# Altium schematic sheet fpga.schdoc
size 350 x 299 mm; Device: A_Customize; Symbol: A_Customize; Name: A_Customize; @Project Name: Odin; REV: 1.0; Date: 2024-09-23; Sheet: 1/1; Draw By: hsinr, ohenley; Company: 12410613_Canada_Corporation; Convert to PCB: yes; Add into BOM: yes; @Page No: 1; @Page Count: 10; @Schematic Name: Odin; @Board Name: Odin_V1.0.0; @Update Date: 2025-12-18; @Create Time: 14:52:40; @Update Time: 10:12:34; @Page Name: fpga; @Create Date: 2025-02-28
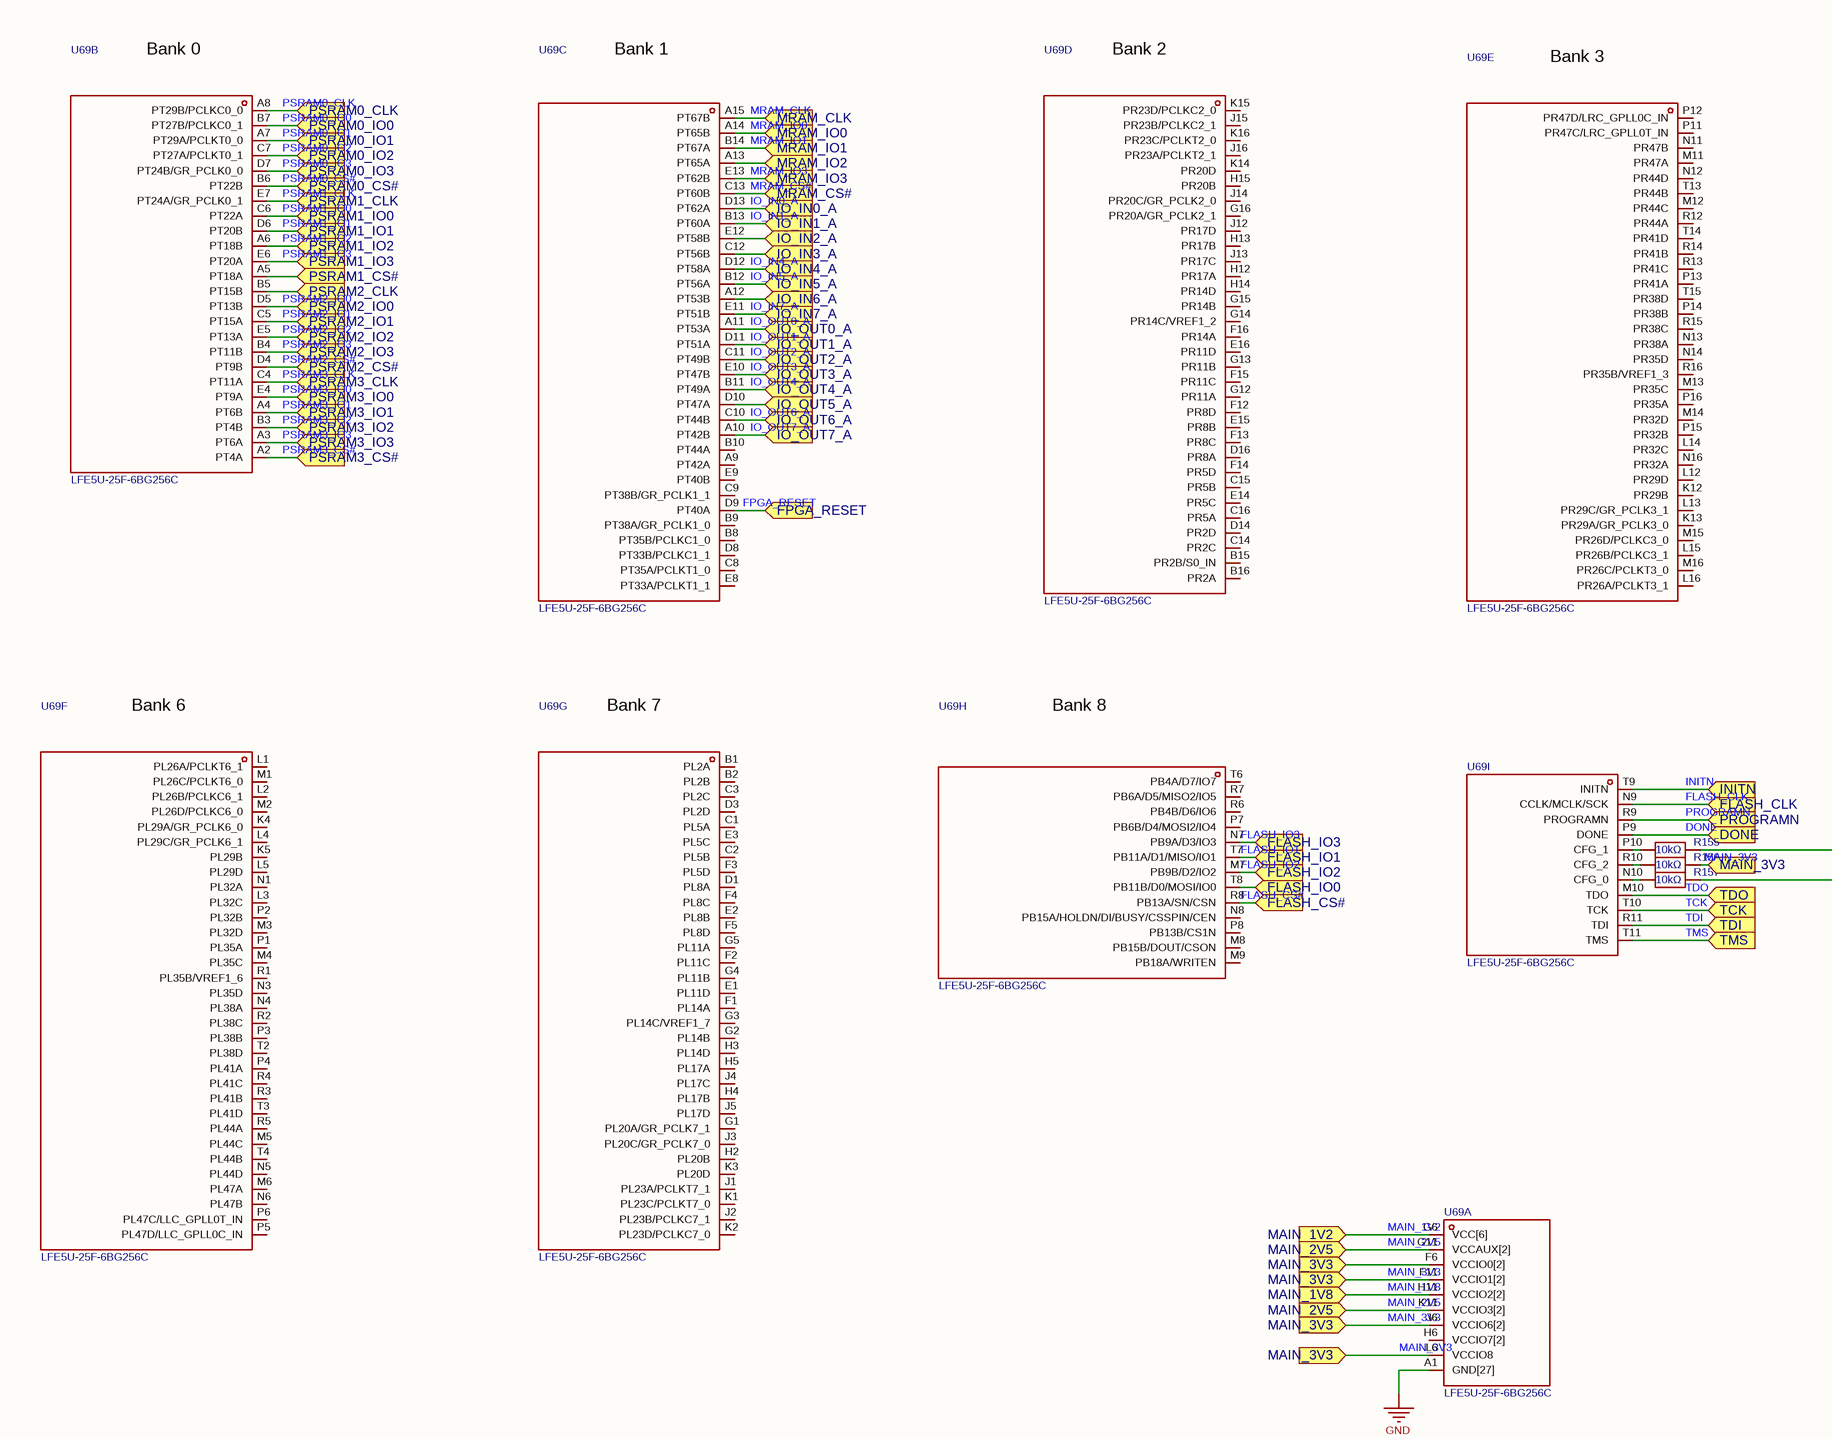
[diagram p0: fpga.schdoc, top left]
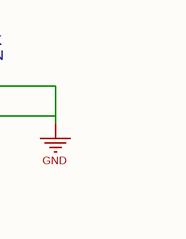
[diagram p1: fpga.schdoc, top right]
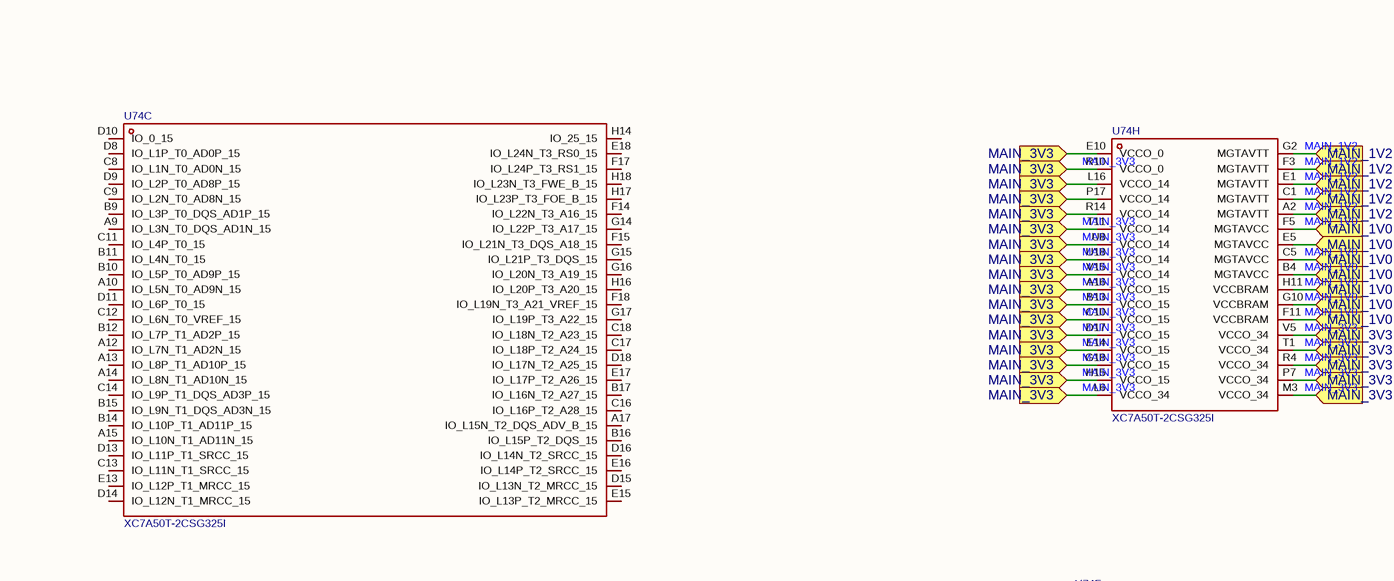
[diagram p2: fpga.schdoc, centre left]
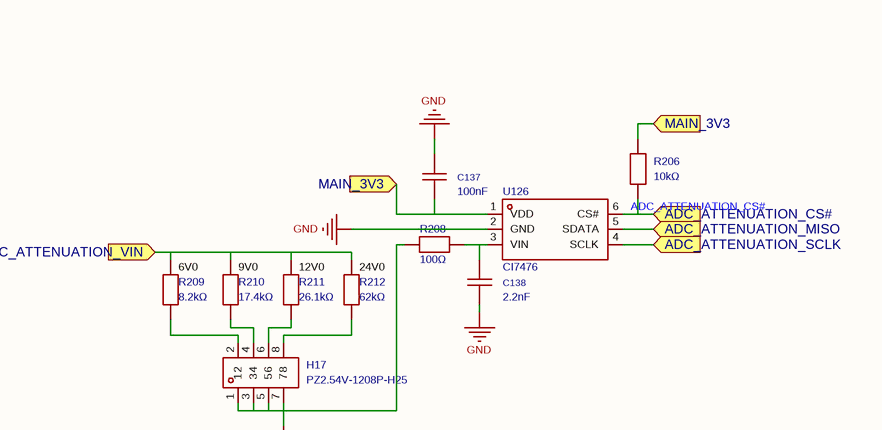
[diagram p3: fpga.schdoc, centre right]
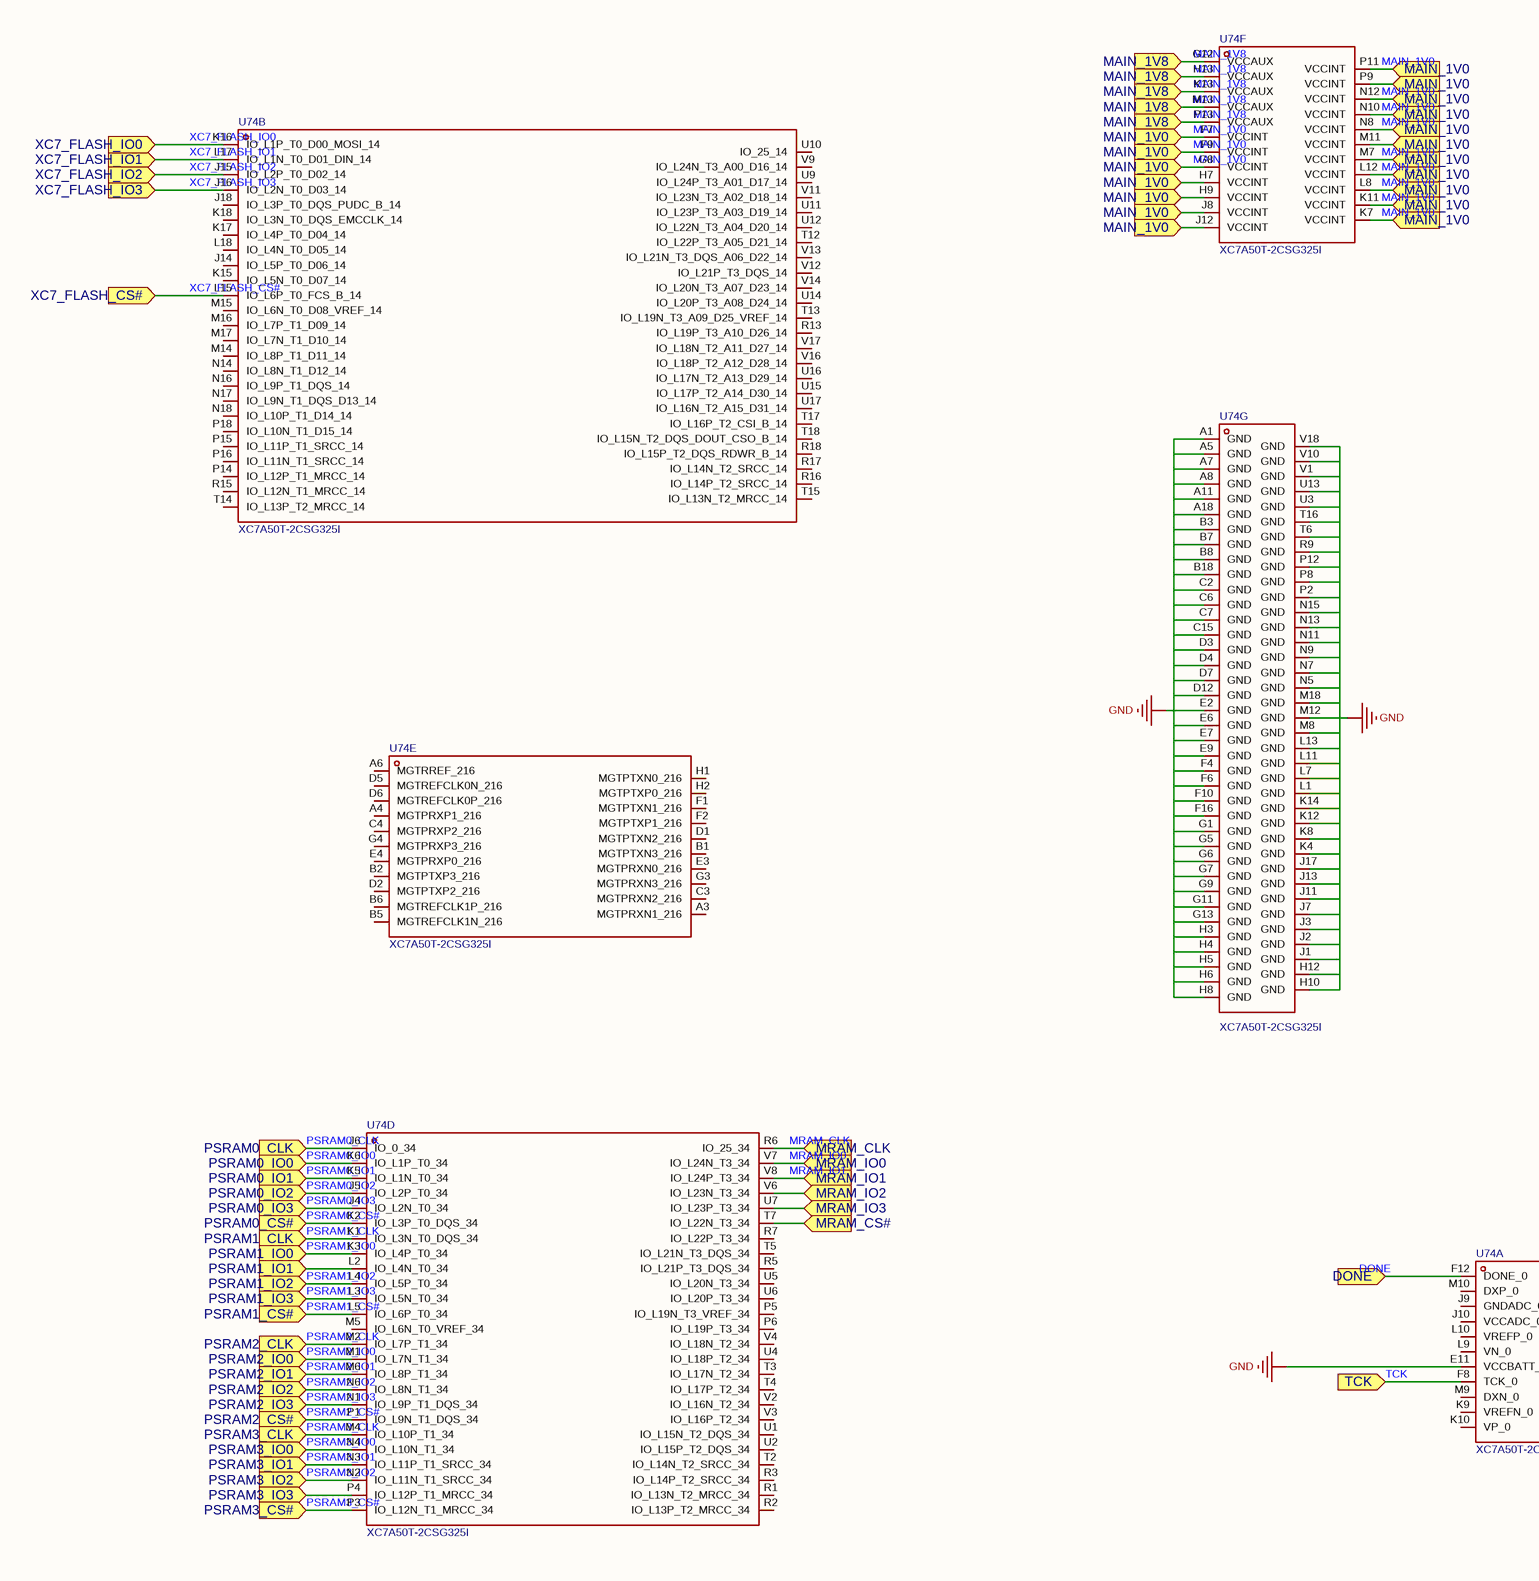
[diagram p4: fpga.schdoc, bottom left]
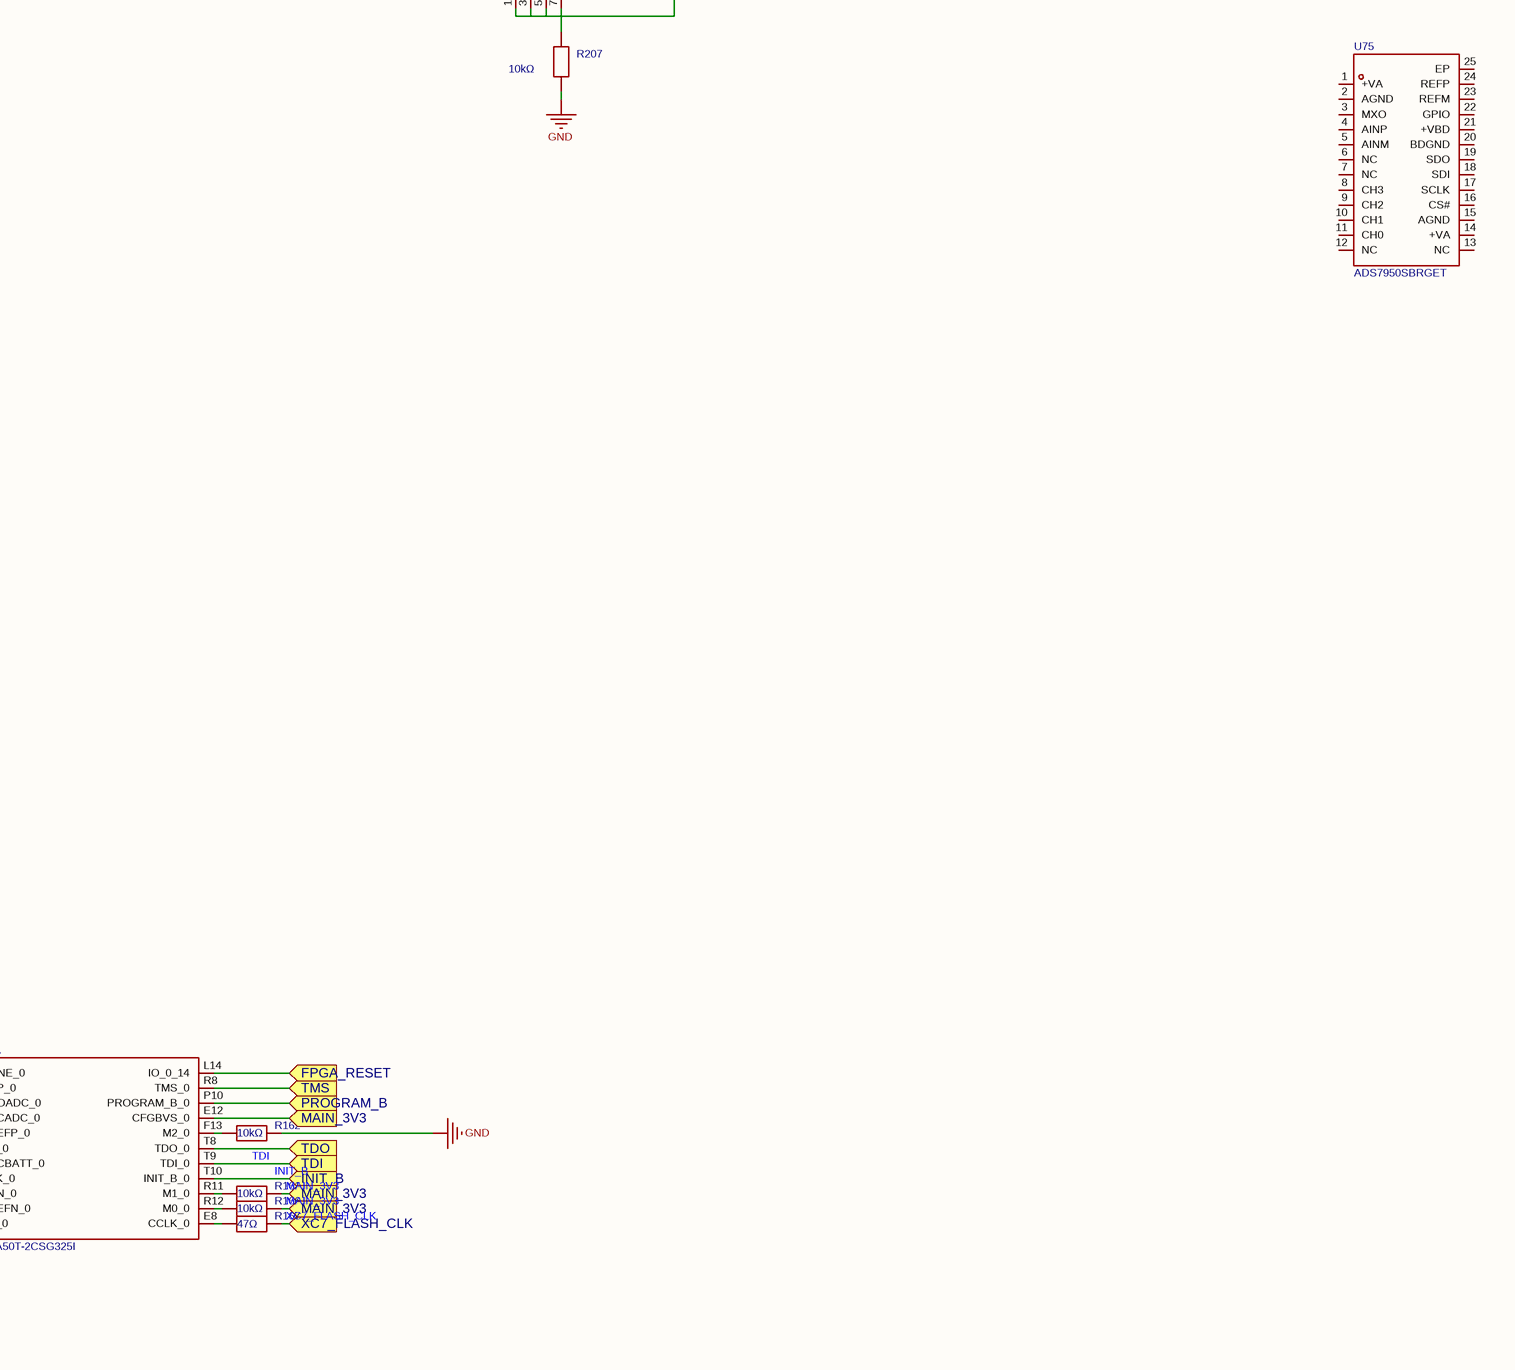
[diagram p5: fpga.schdoc, bottom right]

## Parts
C137  100nF  [C0603]
C138  2.2nF  [C0603]
H17  PZ2.54V-1208P-H25  [HDR-TH_8P-P2.54-V-M-R2-C4-S2.54]
R155  10kΩ  [R0402]
R156  10kΩ  [R0402]
R157  10kΩ  [R0402]
R161  10kΩ  [R0402]
R162  10kΩ  [R0402]
R166  10kΩ  [R0402]
R167  47Ω  [R0402]
R206  10kΩ  [R0402]
R207  10kΩ  [R0402]
R208  100Ω  [R0402]
R209  8.2kΩ  [R0402]
R210  17.4kΩ  [R0402]
R211  26.1kΩ  [R0402]
R212  62kΩ  [R0402]
U69  LFE5U-25F-6BG256C  [CABGA-256_L14.0-W14.0-R16-C16-P0.80-TL]  (parts A,B,C,D,E,F,G,H,I of 9)
U74  XC7A50T-2CSG325I  [NFBGA-324_L15.0-W15.0-R18-C18-P0.80-BL]  (parts A,B,C,D,E,F,G,H of 8)
U75  ADS7950SBRGET  [VQFN-24_L4.0-W4.0-P0.50-TL-EP2.7]
U126  CI7476  [SOT-23-6_L2.9-W1.6-P0.95-LS2.8-BR]

## Ports
ADC_ATTENUATION_CS# (in), ADC_ATTENUATION_MISO (in), ADC_ATTENUATION_SCLK (in), ADC_ATTENUATION_VIN (in), DONE (in), FLASH_CLK (in), FLASH_CS# (in), FLASH_IO0 (in), FLASH_IO1 (in), FLASH_IO2 (in), FLASH_IO3 (in), FPGA_RESET (in), INIT_B (in), INITN (in), IO_IN0_A (in), IO_IN1_A (in), IO_IN2_A (in), IO_IN3_A (in), IO_IN4_A (in), IO_IN5_A (in), IO_IN6_A (in), IO_IN7_A (in), IO_OUT0_A (in), IO_OUT1_A (in), IO_OUT2_A (in), IO_OUT3_A (in), IO_OUT4_A (in), IO_OUT5_A (in), IO_OUT6_A (in), IO_OUT7_A (in), MAIN_1V0 (in), MAIN_1V2 (in), MAIN_1V8 (in), MAIN_2V5 (in), MAIN_3V3 (in), MRAM_CLK (in), MRAM_CS# (in), MRAM_IO0 (in), MRAM_IO1 (in), MRAM_IO2 (in), MRAM_IO3 (in), PROGRAM_B (in), PROGRAMN (in), PSRAM0_CLK (in), PSRAM0_CS# (in), PSRAM0_IO0 (in), PSRAM0_IO1 (in), PSRAM0_IO2 (in), PSRAM0_IO3 (in), PSRAM1_CLK (in), PSRAM1_CS# (in), PSRAM1_IO0 (in), PSRAM1_IO1 (in), PSRAM1_IO2 (in), PSRAM1_IO3 (in), PSRAM2_CLK (in), PSRAM2_CS# (in), PSRAM2_IO0 (in), PSRAM2_IO1 (in), PSRAM2_IO2 (in), PSRAM2_IO3 (in), PSRAM3_CLK (in), PSRAM3_CS# (in), PSRAM3_IO0 (in), PSRAM3_IO1 (in), PSRAM3_IO2 (in), PSRAM3_IO3 (in), TCK (in), TDI (in), TDO (in), TMS (in), XC7_FLASH_CLK (in), XC7_FLASH_CS# (in), XC7_FLASH_IO0 (in), XC7_FLASH_IO1 (in), XC7_FLASH_IO2 (in), XC7_FLASH_IO3 (in)

## Nets
GND: C137.2 C138.2 R155.1 R157.1 R162.1 R207.2 U69.A1(GND[27]) U74.A1(GND) U74.A5(GND) U74.A7(GND) U74.A8(GND) U74.A11(GND) U74.A18(GND) U74.B3(GND) U74.B7(GND) U74.B8(GND) U74.B18(GND) U74.C2(GND) U74.C6(GND) U74.C7(GND) U74.C15(GND) U74.D3(GND) U74.D4(GND) U74.D7(GND) U74.D12(GND) U74.E2(GND) U74.E6(GND) U74.E7(GND) U74.E9(GND) U74.E11(VCCBATT_0) U74.F4(GND) U74.F6(GND) U74.F10(GND) U74.F16(GND) U74.G1(GND) U74.G5(GND) U74.G6(GND) U74.G7(GND) U74.G9(GND) U74.G11(GND) U74.G13(GND) U74.H3(GND) U74.H4(GND) U74.H5(GND) U74.H6(GND) U74.H8(GND) U74.H10(GND) U74.H12(GND) U74.J1(GND) U74.J2(GND) U74.J3(GND) U74.J7(GND) U74.J11(GND) U74.J13(GND) U74.J17(GND) U74.K4(GND) U74.K8(GND) U74.K12(GND) U74.K14(GND) U74.L1(GND) U74.L7(GND) U74.L11(GND) U74.L13(GND) U74.M8(GND) U74.M12(GND) U74.M18(GND) U74.N5(GND) U74.N7(GND) U74.N9(GND) U74.N11(GND) U74.N13(GND) U74.N15(GND) U74.P2(GND) U74.P8(GND) U74.P12(GND) U74.R9(GND) U74.T6(GND) U74.T16(GND) U74.U3(GND) U74.U13(GND) U74.V1(GND) U74.V10(GND) U74.V18(GND) U126.2(GND)
ADC_ATTENUATION_CS#: R206.2 U126.6(CS#) ; port ADC_ATTENUATION_CS#
ADC_ATTENUATION_MISO: U126.5(SDATA) ; port ADC_ATTENUATION_MISO
ADC_ATTENUATION_SCLK: U126.4(SCLK) ; port ADC_ATTENUATION_SCLK
ADC_ATTENUATION_VIN: R209.2 R210.2 R211.2 R212.2 ; port ADC_ATTENUATION_VIN
DONE: U69.P9(DONE) U74.F12(DONE_0) ; port DONE
FLASH_CLK: U69.N9(CCLK/MCLK/SCK) ; port FLASH_CLK
FLASH_CS#: U69.R8(PB13A/SN/CSN) ; port FLASH_CS#
FLASH_IO0: U69.T8(PB11B/D0/MOSI/IO0) ; port FLASH_IO0
FLASH_IO1: U69.T7(PB11A/D1/MISO/IO1) ; port FLASH_IO1
FLASH_IO2: U69.M7(PB9B/D2/IO2) ; port FLASH_IO2
FLASH_IO3: U69.N7(PB9A/D3/IO3) ; port FLASH_IO3
FPGA_RESET: U69.D9(PT40A) U74.L14(IO_0_14) ; port FPGA_RESET
INIT_B: U74.T10(INIT_B_0) ; port INIT_B
INITN: U69.T9(INITN) ; port INITN
IO_IN0_A: U69.D13(PT62A) ; port IO_IN0_A
IO_IN1_A: U69.B13(PT60A) ; port IO_IN1_A
IO_IN2_A: U69.E12(PT58B) ; port IO_IN2_A
IO_IN3_A: U69.C12(PT56B) ; port IO_IN3_A
IO_IN4_A: U69.D12(PT58A) ; port IO_IN4_A
IO_IN5_A: U69.B12(PT56A) ; port IO_IN5_A
IO_IN6_A: U69.A12(PT53B) ; port IO_IN6_A
IO_IN7_A: U69.E11(PT51B) ; port IO_IN7_A
IO_OUT0_A: U69.A11(PT53A) ; port IO_OUT0_A
IO_OUT1_A: U69.D11(PT51A) ; port IO_OUT1_A
IO_OUT2_A: U69.C11(PT49B) ; port IO_OUT2_A
IO_OUT3_A: U69.E10(PT47B) ; port IO_OUT3_A
IO_OUT4_A: U69.B11(PT49A) ; port IO_OUT4_A
IO_OUT5_A: U69.D10(PT47A) ; port IO_OUT5_A
IO_OUT6_A: U69.C10(PT44B) ; port IO_OUT6_A
IO_OUT7_A: U69.A10(PT42B) ; port IO_OUT7_A
MAIN_1V0: U74.B4(MGTAVCC) U74.C5(MGTAVCC) U74.E5(MGTAVCC) U74.F5(MGTAVCC) U74.F7(VCCINT) U74.F9(VCCINT) U74.F11(VCCBRAM) U74.G8(VCCINT) U74.G10(VCCBRAM) U74.H7(VCCINT) U74.H9(VCCINT) U74.H11(VCCBRAM) U74.J8(VCCINT) U74.J12(VCCINT) U74.K7(VCCINT) U74.K11(VCCINT) U74.L8(VCCINT) U74.L12(VCCINT) U74.M7(VCCINT) U74.M11(VCCINT) U74.N8(VCCINT) U74.N10(VCCINT) U74.N12(VCCINT) U74.P9(VCCINT) U74.P11(VCCINT) ; port MAIN_1V0
MAIN_1V2: U69.G6(VCC[6]) U74.A2(MGTAVTT) U74.C1(MGTAVTT) U74.E1(MGTAVTT) U74.F3(MGTAVTT) U74.G2(MGTAVTT) ; port MAIN_1V2
MAIN_1V8: U69.H11(VCCIO2[2]) U74.G12(VCCAUX) U74.H13(VCCAUX) U74.K13(VCCAUX) U74.M13(VCCAUX) U74.P13(VCCAUX) ; port MAIN_1V8
MAIN_2V5: U69.G11(VCCAUX[2]) U69.K11(VCCIO3[2]) ; port MAIN_2V5
MAIN_3V3: C137.1 R156.1 R161.1 R166.1 R206.1 U69.F6(VCCIO0[2]) U69.F11(VCCIO1[2]) U69.J6(VCCIO6[2]) U69.L6(VCCIO8) U74.A16(VCCO_15) U74.B13(VCCO_15) U74.C10(VCCO_15) U74.D17(VCCO_15) U74.E10(VCCO_0) U74.E12(CFGBVS_0) U74.E14(VCCO_15) U74.G18(VCCO_15) U74.H15(VCCO_15) U74.L6(VCCO_34) U74.L16(VCCO_14) U74.M3(VCCO_34) U74.P7(VCCO_34) U74.P17(VCCO_14) U74.R4(VCCO_34) U74.R10(VCCO_0) U74.R14(VCCO_14) U74.T1(VCCO_34) U74.T11(VCCO_14) U74.U8(VCCO_14) U74.U18(VCCO_14) U74.V5(VCCO_34) U74.V15(VCCO_14) U126.1(VDD) ; port MAIN_3V3
MRAM_CLK: U69.A15(PT67B) U74.R6(IO_25_34) ; port MRAM_CLK
MRAM_CS#: U69.C13(PT60B) U74.T7(IO_L22N_T3_34) ; port MRAM_CS#
MRAM_IO0: U69.A14(PT65B) U74.V7(IO_L24N_T3_34) ; port MRAM_IO0
MRAM_IO1: U69.B14(PT67A) U74.V8(IO_L24P_T3_34) ; port MRAM_IO1
MRAM_IO2: U69.A13(PT65A) U74.V6(IO_L23N_T3_34) ; port MRAM_IO2
MRAM_IO3: U69.E13(PT62B) U74.U7(IO_L23P_T3_34) ; port MRAM_IO3
PROGRAM_B: U74.P10(PROGRAM_B_0) ; port PROGRAM_B
PROGRAMN: U69.R9(PROGRAMN) ; port PROGRAMN
PSRAM0_CLK: U69.A8(PT29B/PCLKC0_0) U74.J6(IO_0_34) ; port PSRAM0_CLK
PSRAM0_CS#: U69.B6(PT22B) U74.K2(IO_L3P_T0_DQS_34) ; port PSRAM0_CS#
PSRAM0_IO0: U69.B7(PT27B/PCLKC0_1) U74.K6(IO_L1P_T0_34) ; port PSRAM0_IO0
PSRAM0_IO1: U69.A7(PT29A/PCLKT0_0) U74.K5(IO_L1N_T0_34) ; port PSRAM0_IO1
PSRAM0_IO2: U69.C7(PT27A/PCLKT0_1) U74.J5(IO_L2P_T0_34) ; port PSRAM0_IO2
PSRAM0_IO3: U69.D7(PT24B/GR_PCLK0_0) U74.J4(IO_L2N_T0_34) ; port PSRAM0_IO3
PSRAM1_CLK: U69.E7(PT24A/GR_PCLK0_1) U74.K1(IO_L3N_T0_DQS_34) ; port PSRAM1_CLK
PSRAM1_CS#: U69.A5(PT18A) U74.L5(IO_L6P_T0_34) ; port PSRAM1_CS#
PSRAM1_IO0: U69.C6(PT22A) U74.K3(IO_L4P_T0_34) ; port PSRAM1_IO0
PSRAM1_IO1: U69.D6(PT20B) U74.L2(IO_L4N_T0_34) ; port PSRAM1_IO1
PSRAM1_IO2: U69.A6(PT18B) U74.L4(IO_L5P_T0_34) ; port PSRAM1_IO2
PSRAM1_IO3: U69.E6(PT20A) U74.L3(IO_L5N_T0_34) ; port PSRAM1_IO3
PSRAM2_CLK: U69.B5(PT15B) U74.M2(IO_L7P_T1_34) ; port PSRAM2_CLK
PSRAM2_CS#: U69.D4(PT9B) U74.P1(IO_L9N_T1_DQS_34) ; port PSRAM2_CS#
PSRAM2_IO0: U69.D5(PT13B) U74.M1(IO_L7N_T1_34) ; port PSRAM2_IO0
PSRAM2_IO1: U69.C5(PT15A) U74.M6(IO_L8P_T1_34) ; port PSRAM2_IO1
PSRAM2_IO2: U69.E5(PT13A) U74.N6(IO_L8N_T1_34) ; port PSRAM2_IO2
PSRAM2_IO3: U69.B4(PT11B) U74.N1(IO_L9P_T1_DQS_34) ; port PSRAM2_IO3
PSRAM3_CLK: U69.C4(PT11A) U74.M4(IO_L10P_T1_34) ; port PSRAM3_CLK
PSRAM3_CS#: U69.A2(PT4A) U74.P3(IO_L12N_T1_MRCC_34) ; port PSRAM3_CS#
PSRAM3_IO0: U69.E4(PT9A) U74.N4(IO_L10N_T1_34) ; port PSRAM3_IO0
PSRAM3_IO1: U69.A4(PT6B) U74.N3(IO_L11P_T1_SRCC_34) ; port PSRAM3_IO1
PSRAM3_IO2: U69.B3(PT4B) U74.N2(IO_L11N_T1_SRCC_34) ; port PSRAM3_IO2
PSRAM3_IO3: U69.A3(PT6A) U74.P4(IO_L12P_T1_MRCC_34) ; port PSRAM3_IO3
TCK: U69.T10(TCK) U74.F8(TCK_0) ; port TCK
TDI: U69.R11(TDI) U74.T9(TDI_0) ; port TDI
TDO: U69.M10(TDO) U74.T8(TDO_0) ; port TDO
TMS: U69.T11(TMS) U74.R8(TMS_0) ; port TMS
XC7_FLASH_CLK: R167.1 ; port XC7_FLASH_CLK
XC7_FLASH_CS#: U74.L15(IO_L6P_T0_FCS_B_14) ; port XC7_FLASH_CS#
XC7_FLASH_IO0: U74.K16(IO_L1P_T0_D00_MOSI_14) ; port XC7_FLASH_IO0
XC7_FLASH_IO1: U74.L17(IO_L1N_T0_D01_DIN_14) ; port XC7_FLASH_IO1
XC7_FLASH_IO2: U74.J15(IO_L2P_T0_D02_14) ; port XC7_FLASH_IO2
XC7_FLASH_IO3: U74.J16(IO_L2N_T0_D03_14) ; port XC7_FLASH_IO3
NetC138_1: C138.1 R208.2 U126.3(VIN)
NetH17_1: H17.1 H17.3 H17.5 H17.7 R207.1 R208.1
NetH17_2: H17.2 R209.1
NetH17_4: H17.4 R210.1
NetH17_6: H17.6 R211.1
NetH17_8: H17.8 R212.1
NetR155_2: R155.2 U69.P10(CFG_1)
NetR156_2: R156.2 U69.R10(CFG_2)
NetR157_2: R157.2 U69.N10(CFG_0)
NetR161_2: R161.2 U74.R11(M1_0)
NetR162_2: R162.2 U74.F13(M2_0)
NetR166_2: R166.2 U74.R12(M0_0)
NetR167_2: R167.2 U74.E8(CCLK_0)

Not connected (* = marked no-connect by the designer): U69 A9(PT42A) B1(PL2A) B2(PL2B) B8(PT35B/PCLKC1_0) B9(PT38A/GR_PCLK1_0) B10(PT44A) B15(PR2B/S0_IN) B16(PR2A) C1(PL5A) C2(PL5B) C3(PL2C) C8(PT35A/PCLKT1_0) C9(PT38B/GR_PCLK1_1) C14(PR2C) C15(PR5B) C16(PR5A) D1(PL8A) D3(PL2D) D8(PT33B/PCLKC1_1) D14(PR2D) D16(PR8A) E1(PL11D) E2(PL8B) E3(PL5C) E8(PT33A/PCLKT1_1) E9(PT40B) E14(PR5C) E15(PR8B) E16(PR11D) F1(PL14A) F2(PL11C) F3(PL5D) F4(PL8C) F5(PL8D) F12(PR8D) F13(PR8C) F14(PR5D) F15(PR11C) F16(PR14A) G1(PL20A/GR_PCLK7_1) G2(PL14B) G3(PL14C/VREF1_7) G4(PL11B) G5(PL11A) G12(PR11A) G13(PR11B) G14(PR14C/VREF1_2) G15(PR14B) G16(PR20A/GR_PCLK2_1) H2(PL20B) H3(PL14D) H4(PL17B) H5(PL17A) H6(VCCIO7[2]) H12(PR17A) H13(PR17B) H14(PR14D) H15(PR20B) J1(PL23A/PCLKT7_1) J2(PL23B/PCLKC7_1) J3(PL20C/GR_PCLK7_0) J4(PL17C) J5(PL17D) J12(PR17D) J13(PR17C) J14(PR20C/GR_PCLK2_0) J15(PR23B/PCLKC2_1) J16(PR23A/PCLKT2_1) K1(PL23C/PCLKT7_0) K2(PL23D/PCLKC7_0) K3(PL20D) K4(PL29A/GR_PCLK6_0) K5(PL29B) K12(PR29B) K13(PR29A/GR_PCLK3_0) K14(PR20D) K15(PR23D/PCLKC2_0) K16(PR23C/PCLKT2_0) L1(PL26A/PCLKT6_1) L2(PL26B/PCLKC6_1) L3(PL32C) L4(PL29C/GR_PCLK6_1) L5(PL29D) L12(PR29D) L13(PR29C/GR_PCLK3_1) L14(PR32C) L15(PR26B/PCLKC3_1) L16(PR26A/PCLKT3_1) M1(PL26C/PCLKT6_0) M2(PL26D/PCLKC6_0) M3(PL32D) M4(PL35C) M5(PL44C) M6(PL47A) M8(PB15B/DOUT/CSON) M9(PB18A/WRITEN) M11(PR47A) M12(PR44C) M13(PR35C) M14(PR32D) M15(PR26D/PCLKC3_0) M16(PR26C/PCLKT3_0) N1(PL32A) N3(PL35D) N4(PL38A) N5(PL44D) N6(PL47B) N8(PB15A/HOLDN/DI/BUSY/CSSPIN/CEN) N11(PR47B) N12(PR44D) N13(PR38A) N14(PR35D) N16(PR32A) P1(PL35A) P2(PL32B) P3(PL38B) P4(PL41A) P5(PL47D/LLC_GPLL0C_IN) P6(PL47C/LLC_GPLL0T_IN) P7(PB6B/D4/MOSI2/IO4) P8(PB13B/CS1N) P11(PR47C/LRC_GPLL0T_IN) P12(PR47D/LRC_GPLL0C_IN) P13(PR41A) P14(PR38B) P15(PR32B) P16(PR35A) R1(PL35B/VREF1_6) R2(PL38C) R3(PL41B) R4(PL41C) R5(PL44A) R6(PB4B/D6/IO6) R7(PB6A/D5/MISO2/IO5) R12(PR44A) R13(PR41C) R14(PR41B) R15(PR38C) R16(PR35B/VREF1_3) T2(PL38D) T3(PL41D) T4(PL44B) T6(PB4A/D7/IO7) T13(PR44B) T14(PR41D) T15(PR38D); U74 A3(MGTPRXN1_216) A4(MGTPRXP1_216) A6(MGTRREF_216) A9(IO_L3N_T0_DQS_AD1N_15) A10(IO_L5N_T0_AD9N_15) A12(IO_L7N_T1_AD2N_15) A13(IO_L8P_T1_AD10P_15) A14(IO_L8N_T1_AD10N_15) A15(IO_L10N_T1_AD11N_15) A17(IO_L15N_T2_DQS_ADV_B_15) B1(MGTPTXN3_216) B2(MGTPTXP3_216) B5(MGTREFCLK1N_216) B6(MGTREFCLK1P_216) B9(IO_L3P_T0_DQS_AD1P_15) B10(IO_L5P_T0_AD9P_15) B11(IO_L4N_T0_15) B12(IO_L7P_T1_AD2P_15) B14(IO_L10P_T1_AD11P_15) B15(IO_L9N_T1_DQS_AD3N_15) B16(IO_L15P_T2_DQS_15) B17(IO_L16N_T2_A27_15) C3(MGTPRXN2_216) C4(MGTPRXP2_216) C8(IO_L1N_T0_AD0N_15) C9(IO_L2N_T0_AD8N_15) C11(IO_L4P_T0_15) C12(IO_L6N_T0_VREF_15) C13(IO_L11N_T1_SRCC_15) C14(IO_L9P_T1_DQS_AD3P_15) C16(IO_L16P_T2_A28_15) C17(IO_L18P_T2_A24_15) C18(IO_L18N_T2_A23_15) D1(MGTPTXN2_216) D2(MGTPTXP2_216) D5(MGTREFCLK0N_216) D6(MGTREFCLK0P_216) D8(IO_L1P_T0_AD0P_15) D9(IO_L2P_T0_AD8P_15) D10(IO_0_15) D11(IO_L6P_T0_15) D13(IO_L11P_T1_SRCC_15) D14(IO_L12N_T1_MRCC_15) D15(IO_L13N_T2_MRCC_15) D16(IO_L14N_T2_SRCC_15) D18(IO_L17N_T2_A25_15) E3(MGTPRXN0_216) E4(MGTPRXP0_216) E13(IO_L12P_T1_MRCC_15) E15(IO_L13P_T2_MRCC_15) E16(IO_L14P_T2_SRCC_15) E17(IO_L17P_T2_A26_15) E18(IO_L24N_T3_RS0_15) F1(MGTPTXN1_216) F2(MGTPTXP1_216) F14(IO_L22N_T3_A16_15) F15(IO_L21N_T3_DQS_A18_15) F17(IO_L24P_T3_RS1_15) F18(IO_L19N_T3_A21_VREF_15) G3(MGTPRXN3_216) G4(MGTPRXP3_216) G14(IO_L22P_T3_A17_15) G15(IO_L21P_T3_DQS_15) G16(IO_L20N_T3_A19_15) G17(IO_L19P_T3_A22_15) H1(MGTPTXN0_216) H2(MGTPTXP0_216) H14(IO_25_15) H16(IO_L20P_T3_A20_15) H17(IO_L23P_T3_FOE_B_15) H18(IO_L23N_T3_FWE_B_15) J9(GNDADC_0) J10(VCCADC_0) J14(IO_L5P_T0_D06_14) J18(IO_L3P_T0_DQS_PUDC_B_14) K9(VREFN_0) K10(VP_0) K15(IO_L5N_T0_D07_14) K17(IO_L4P_T0_D04_14) K18(IO_L3N_T0_DQS_EMCCLK_14) L9(VN_0) L10(VREFP_0) L18(IO_L4N_T0_D05_14) M5(IO_L6N_T0_VREF_34) M9(DXN_0) M10(DXP_0) M14(IO_L8P_T1_D11_14) M15(IO_L6N_T0_D08_VREF_14) M16(IO_L7P_T1_D09_14) M17(IO_L7N_T1_D10_14) N14(IO_L8N_T1_D12_14) N16(IO_L9P_T1_DQS_14) N17(IO_L9N_T1_DQS_D13_14) N18(IO_L10P_T1_D14_14) P5(IO_L19N_T3_VREF_34) P6(IO_L19P_T3_34) P14(IO_L12P_T1_MRCC_14) P15(IO_L11P_T1_SRCC_14) P16(IO_L11N_T1_SRCC_14) P18(IO_L10N_T1_D15_14) R1(IO_L13N_T2_MRCC_34) R2(IO_L13P_T2_MRCC_34) R3(IO_L14P_T2_SRCC_34) R5(IO_L21P_T3_DQS_34) R7(IO_L22P_T3_34) R13(IO_L19P_T3_A10_D26_14) R15(IO_L12N_T1_MRCC_14) R16(IO_L14P_T2_SRCC_14) R17(IO_L14N_T2_SRCC_14) R18(IO_L15P_T2_DQS_RDWR_B_14) T2(IO_L14N_T2_SRCC_34) T3(IO_L17N_T2_34) T4(IO_L17P_T2_34) T5(IO_L21N_T3_DQS_34) T12(IO_L22P_T3_A05_D21_14) T13(IO_L19N_T3_A09_D25_VREF_14) T14(IO_L13P_T2_MRCC_14) T15(IO_L13N_T2_MRCC_14) T17(IO_L16P_T2_CSI_B_14) T18(IO_L15N_T2_DQS_DOUT_CSO_B_14) U1(IO_L15N_T2_DQS_34) U2(IO_L15P_T2_DQS_34) U4(IO_L18P_T2_34) U5(IO_L20N_T3_34) U6(IO_L20P_T3_34) U9(IO_L24P_T3_A01_D17_14) U10(IO_25_14) U11(IO_L23P_T3_A03_D19_14) U12(IO_L22N_T3_A04_D20_14) U14(IO_L20P_T3_A08_D24_14) U15(IO_L17P_T2_A14_D30_14) U16(IO_L17N_T2_A13_D29_14) U17(IO_L16N_T2_A15_D31_14) V2(IO_L16N_T2_34) V3(IO_L16P_T2_34) V4(IO_L18N_T2_34) V9(IO_L24N_T3_A00_D16_14) V11(IO_L23N_T3_A02_D18_14) V12(IO_L21P_T3_DQS_14) V13(IO_L21N_T3_DQS_A06_D22_14) V14(IO_L20N_T3_A07_D23_14) V16(IO_L18P_T2_A12_D28_14) V17(IO_L18N_T2_A11_D27_14); U75 1(+VA) 2(AGND) 3(MXO) 4(AINP) 5(AINM) 6(NC) 7(NC) 8(CH3) 9(CH2) 10(CH1) 11(CH0) 12(NC) 13(NC) 14(+VA) 15(AGND) 16(CS#) 17(SCLK) 18(SDI) 19(SDO) 20(BDGND) 21(+VBD) 22(GPIO) 23(REFM) 24(REFP) 25(EP)

## Notes on the sheet
- (near R209) 6V0
- (near R210) 9V0
- (near R211) 12V0
- (near R212) 24V0
- 1
- 2
- 3
- 4
- 5
- 6
- A
- B
- C
- D
- E
- TITLE:
- Odin
- Company:
- 12410613_Canada_Corporation
- Sheet:
- REV:
- 1.0
- 1/1
- Date:
- 2024-09-23
- Drawn By:
- hsinr, ohenley
- (in symbol LFE5U-25F-6BG256C, part B) Bank 0
- (in symbol LFE5U-25F-6BG256C, part C) Bank 1
- (in symbol LFE5U-25F-6BG256C, part D) Bank 2
- (in symbol LFE5U-25F-6BG256C, part E) Bank 3
- (in symbol LFE5U-25F-6BG256C, part F) Bank 6
- (in symbol LFE5U-25F-6BG256C, part G) Bank 7
- (in symbol LFE5U-25F-6BG256C, part H) Bank 8

## Library data of the parts
C137 C138 = CL10B223KB8NNNC: Capacitance:22nF Tolerance:±10% Tolerance:±10% Voltage Rating:50V Temperature Coefficient:X7R; Manufacturer: SAMSUNG(三星); AddInBom: yes; ModelId: 624118aa3cc7497086c383c2d72e0852; ModelName: C0603_L1.6-W0.8-H0.8; ModelTransform: 62.992,31.496,0,0,0,0,0,0,0; Tolerance: ±10%; Voltage Rating: 50V; Temperature Coefficient: X7R; Symbol: CL10B223KB8NNNC; Device: CL10B223KB8NNNC; Supplier: LCSC; Manufacturer Part: CL10B223KB8NNNC; JLCPCB Part Class: Basic Part; LCSC Part Name: 22nF ±10% 50V; Supplier Footprint: 0603; Datasheet: https://item.szlcsc.com/datasheet/CL10B223KB8NNNC/21834.html; ConvertToPcb: yes; FootprintName: C0603
  C137: Value: 100nF
  C138: Value: 2.2nF
H17 = PZ2.54V-1208P-H25: Pin Structure:2x4P Pitch:2.54mm Row Spacing:2.54mm Circluar Pins/Square Pins:Pin Header Mounting Type:Through Hole Number of Rows:2 Number of Pins:8P Current Rating:3A Voltage Rating (Max):- Length of Mating Pin:6mm Insulation Height:2.5mm Length of End C; Manufacturer: JXTCONN(聚兴泰); AddInBom: yes; ModelId: 47b5ce995b664298ab05f1b74b77106f; ModelName: HDR-TH_8P-P2.54-M-LI-2X4P; ModelTransform: 399.999,200,0,0,0,0,0,0,-118.11; Pin Structure: 2x4P; Pitch: 2.54mm; Current Rating: 3A; Symbol: PZ2.54V-1208P-H25; Device: PZ2.54V-1208P-H25; LCSC Part Name: 2x4P 间距:2.54mm 方针 直插; SupplierPart: C42431793; ManufacturerPart: PZ2.54V-1208P-H25; Supplier Footprint: 插件,P=2.54mm; JLCPCB Part Class: Extended Part; Datasheet: https://item.szlcsc.com/datasheet/PZ2.54V-1208P-H25/44458923.html; Supplier: LCSC; ConvertToPcb: yes; FootprintName: HDR-TH_8P-P2.54-V-M-R2-C4-S2.54; Row Spacing: 2.54mm; Circluar Pins/Square Pins: Pin Header; Mounting Type: Through Hole; Number of Rows: 2; Number of Pins: 8P; Voltage Rating (Max): -; Length of Mating Pin: 6mm; Insulation Height: 2.5mm; Length of End Connection Pin: 3mm; Contact Material: Copper Alloy; Contact Plating: Gold; Operating Temperature: -40℃~+105℃; Color: Black
R155-R157 R161 R162 R166 R167 R206-R212 = FRC0402F3002TS: Type:Thick Film Resistor Resistance:30kΩ Tolerance:±1% Tolerance:±1% Power(Watts):62.5mW Voltage-Supply(Max):50V Temperature Coefficient:±100ppm/℃ Temperature Coefficient:±100ppm/℃ Operating Temperature:-55℃~+155℃ Operating Temperature:-55℃~+155℃; Manufacturer: FOJAN(富捷); AddInBom: yes; ModelId: efdecb7dae4442949d28eecaf748420f; ModelName: R0402_L1.0-W0.5-H0.4; ModelTransform: 39.37,19.685,0,0,0,0,0,0,0; Tolerance: ±1%; Power(Watts): 62.5mW; Voltage-Supply(Max): 50V; Symbol: FRC0402F3002TS; Device: FRC0402F3002TS; LCSC Part Name: 30kΩ ±1% 62.5mW 厚膜电阻; ManufacturerPart: FRC0402F3002TS; Supplier Footprint: 0402; JLCPCB Part Class: Extended Part; Supplier: LCSC; ConvertToPcb: yes; FootprintName: R0402; Type: Thick Film Resistor; Temperature Coefficient: ±100ppm/℃; Operating Temperature: -55℃~+155℃
  R155-R157 R161 R162 R166 R206 R207: Value: 10kΩ
  R167: Value: 47Ω
  R208: Value: 100Ω
  R209: Value: 8.2kΩ
  R210: Value: 17.4kΩ
  R211: Value: 26.1kΩ
  R212: Value: 62kΩ
U69 = LFE5U-25F-6BG256C: Manufacturer: LATTICE(莱迪思); Relevance: []; ConvertToPcb: yes; Symbol: LFE5U-25F-6BG256C; Device: LFE5U-25F-6BG256C; ManufacturerPart: LFE5U-25F-6BG256C; Supplier: LCSC; SupplierPart: C1521614; AddInBom: yes; FootprintName: CABGA-256_L14.0-W14.0-R16-C16-P0.80-TL
U74 = XC7A50T-2CSG325I: Manufacturer: AMD/XILINX(赛灵思); Relevance: []; AddInBom: yes; ModelId: 69a719b971894152817a7d9493aabc0b; ModelTransform: 590.55,590.55,0,0,0,0,0,0,0; Symbol: XC7A50T-2CSG325I; Device: XC7A50T-2CSG325I; LCSC Part Name: - XC7A50T 2CSG325I; SupplierPart: C1521759; ManufacturerPart: XC7A50T-2CSG325I; Supplier Footprint: FPGA-325(15x15); JLCPCB Part Class: Extended Part; Datasheet: https://item.szlcsc.com/datasheet/XC7A50T-2CSG325I/1612557.html; Supplier: LCSC; ConvertToPcb: yes; FootprintName: NFBGA-324_L15.0-W15.0-R18-C18-P0.80-BL; ModelName: NFBGA-324_L15.0-W15.0-R18-C18-P0.80-BL
U75 = ADS7950SBRGET: Resolution(Bits):12 Sampling Rate:1MHz number of channels:4 Voltage - Supply:2.7V~5.25V Voltage - Supply:2.7V~5.25V Interface:Serial differential input:No Integral non - linearity:1LSB Integral non - linearity:1LSB Operating Temperature:-40℃~+125℃ Operati; Manufacturer: TI(德州仪器); AddInBom: yes; ModelId: a00e61f9da8d4618b24adadc0e1be5c9; ModelTransform: 157.48,157.48,0,0,0,0,0.004,0,0; Resolution(Bits): 12; Sampling Rate: 1MHz; number of channels: 4; Interface: Serial; differential input: No; Integral non - linearity: 1LSB; Signal-to-Noise Ratio: 71.7dB; Clock Frequency: 20MHz; ADC architecture: SAR; Supply Current (Iq): 1uA; Symbol: ADS7950SBRGET; Device: ADS7950SBRGET; LCSC Part Name: 兼容引脚型多通道、串行接口ADC; SupplierPart: C2861275; ManufacturerPart: ADS7950SBRGET; Supplier Footprint: VQFN-24-EP(4x4); JLCPCB Part Class: Extended Part; Datasheet: https://www.ti.com/cn/lit/gpn/ads7955; Supplier: LCSC; ConvertToPcb: yes; FootprintName: VQFN-24_L4.0-W4.0-P0.50-TL-EP2.7; ModelName: VQFN-24_L4.0-W4.0-P0.50-TL-EP2.7; Voltage - Supply: 2.7V~5.25V; Operating Temperature: -40℃~+125℃
U126 = CI7476: Resolution(Bits):12 Sampling Rate:800kHz number of channels:1 Voltage - Supply:4V~5.25V Voltage - Supply:4V~5.25V Interface:SPI differential input:- Integral non - linearity:1.25LSB Integral non - linearity:1.25LSB Operating Temperature:-40℃~+85℃ Operatin; Manufacturer: Tokmas(托克马斯); AddInBom: yes; ModelId: 1370be37a17e44418ae52e2b4cc1f5e5; ModelName: SOT-23-6_L2.9-W1.6-H1.5-LS2.8-P0.95; ModelTransform: 110.73671,114.173,0,180,0,0,0.001,-0.003,0; Resolution(Bits): 12; Sampling Rate: 800kHz; number of channels: 1; Interface: SPI; Signal-to-Noise Ratio: 71.5dB; Clock Frequency: 20MHz；16MHz; ADC architecture: SAR; Symbol: CI7476; Device: CI7476; LCSC Part Name: 1MSPS/800ksps，3.3V-5.25V，12/10/8bit SAR模数转换器; SupplierPart: C41415530; ManufacturerPart: CI7476; Supplier Footprint: SOT-23-6; JLCPCB Part Class: Extended Part; Datasheet: https://item.szlcsc.com/datasheet/CI7476/43235418.html; Supplier: LCSC; ConvertToPcb: yes; FootprintName: SOT-23-6_L2.9-W1.6-P0.95-LS2.8-BR; Voltage - Supply: 4V~5.25V; differential input: -; Integral non - linearity: 1.25LSB; Operating Temperature: -40℃~+85℃